# Altium schematic sheet ESP_Sheild.SchDoc
size A4; SheetNumber: 1; SheetTotal: 1
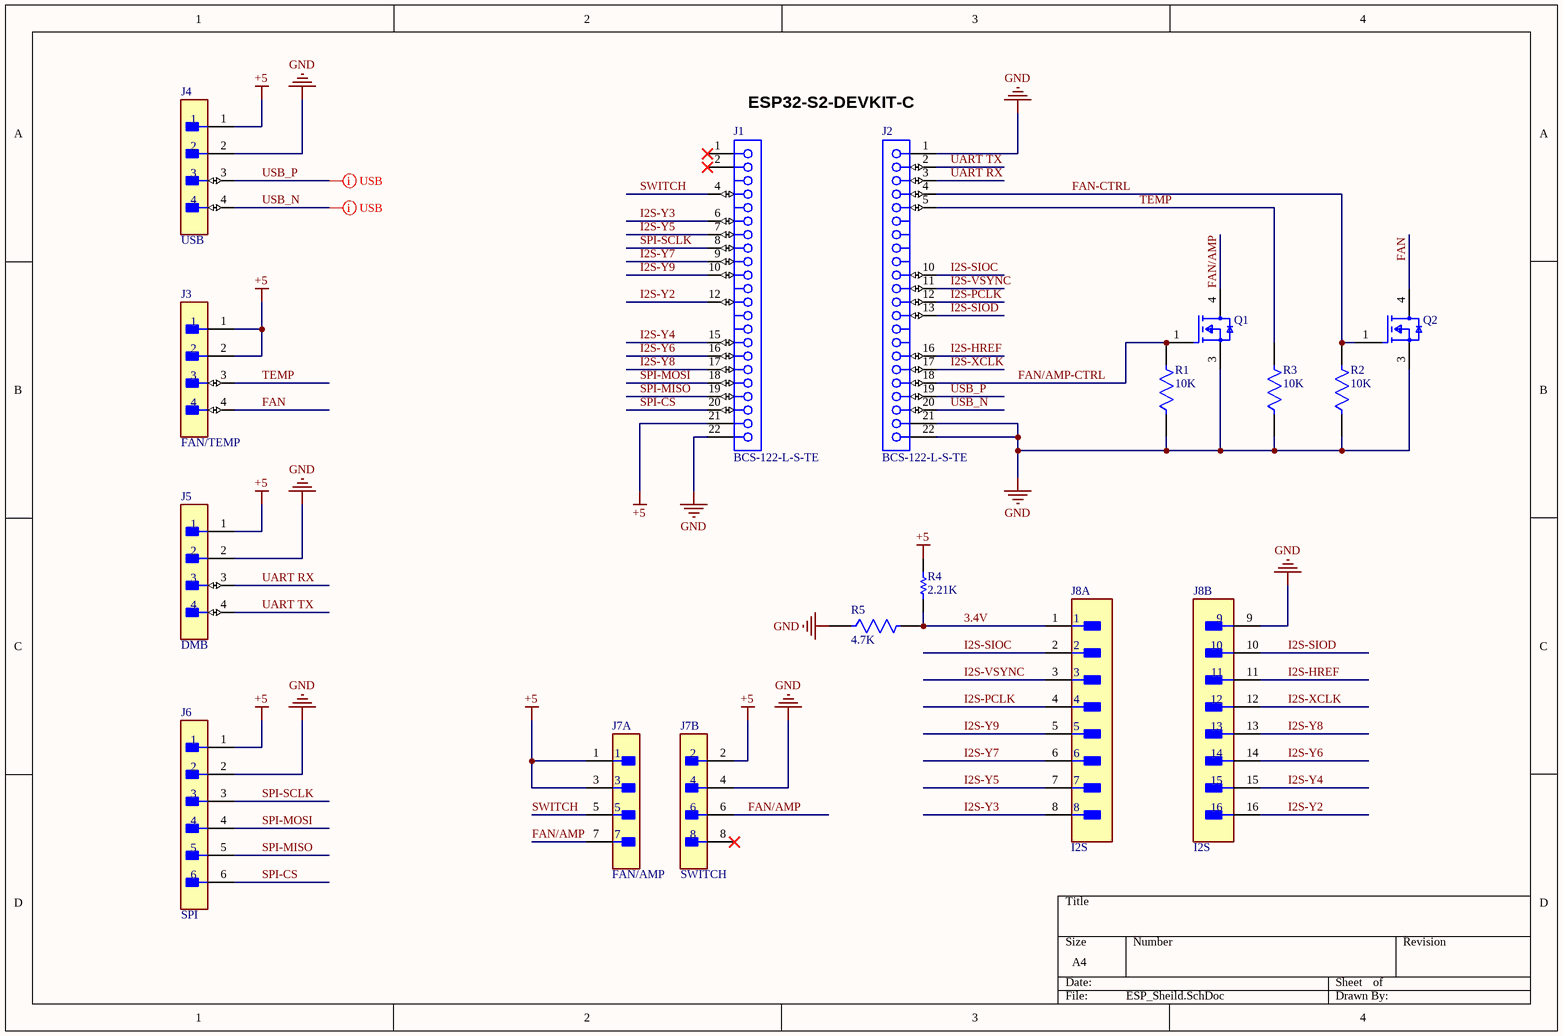
[diagram p0: ESP_Sheild.SchDoc]

## Parts
J1  BCS-122-L-S-TE  [SMTC-BCS-122-X-S-TE]
J2  BCS-122-L-S-TE  [SMTC-BCS-122-X-S-TE]
J3  FAN/TEMP  [FP-43045-0400-MFG]
J4  USB  [FP-43045-0400-MFG]
J5  DMB  [FP-43045-0400-MFG]
J6  SPI  [FP-43045-0612-MFG]
J7  FAN/AMP  [FP-43045-0827-0]  (parts A,B of 2)
J8  I2S  [FP-1723161216-MFG]  (parts A,B of 2)
Q1  DMN6068LK3-13  [FP-TO252_DPAK-MFG]  (value not drawn)
Q2  DMN6068LK3-13  [FP-TO252_DPAK-MFG]  (value not drawn)
R1  10K  [FP-ERJ3G-IPC_A]
R2  10K  [FP-ERJ3G-IPC_A]
R3  10K  [FP-ERJ3G-IPC_A]
R4  2.21K  [RESC1608X55X30LL15T15]
R5  4.7K  [FP-RMCF0603-MFG]

## Nets
+5: J1.21(5V) J3.1(5V) J3.2(5V) J4.1(5V) J5.1(5V) J6.1(5V) J7.1(5V) J7.2 J7.3(5V) R4.2
GND: J1.22(GND) J2.1(GND) J2.21(GND) J2.22(GND) J4.2(GND) J5.2(GND) J6.2(GND) J7.4 J8.9 Q1.3(S) Q2.3(S) R1.1 R2.1 R3.1 R5.1
3.4V: J8.1(3V3) R4.1 R5.2
FAN: J3.4(FAN) Q2.4(D)
FAN-CTRL: J2.4(GPIO1) Q2.1(G) R2.2
FAN/AMP: J7.6 J7.7(FAN/AMP) Q1.4(D)
FAN/AMP-CTRL: J2.18(GPIO21) Q1.1(G) R1.2
I2S-HREF: J2.16(GPIO34) J8.11
I2S-PCLK: J2.12(GPIO36) J8.4(VSYNC)
I2S-SIOC: J2.10(GPIO38) J8.2(PCLK)
I2S-SIOD: J2.13(GPIO35) J8.10
I2S-VSYNC: J2.11(GPIO37) J8.3(HREF)
I2S-XCLK: J2.17(GPIO33) J8.12
I2S-Y2: J1.12(GPIO8) J8.16
I2S-Y3: J1.6(GPIO6) J8.8(Y2)
I2S-Y4: J1.15(GPIO9) J8.15
I2S-Y5: J1.7(GPIO7) J8.7(XCLK)
I2S-Y6: J1.16(GPIO10) J8.14
I2S-Y7: J1.9(GPIO16) J8.6(SIOD)
I2S-Y8: J1.17(GPIO11) J8.13
I2S-Y9: J1.10(GPIO17) J8.5(SIOC)
SPI-CS: J1.20(GPIO14) J6.6(CS)
SPI-MISO: J1.19(GPIO13) J6.5(MISO)
SPI-MOSI: J1.18(GPIO12) J6.4(MOSI)
SPI-SCLK: J1.8(GPIO15) J6.3(SCLK)
SWITCH: J1.4(GPIO4) J7.5(FAN/AMP)
TEMP: J2.5(GPIO2) J3.3(TEMP) R3.2
UART RX: J2.3(GPIO44) J5.3(UART-TX)
UART TX: J2.2(GPIO43) J5.4(UART-RX)
USB_N: J2.20(GPIO19) J4.4
USB_P: J2.19(GPIO20) J4.3

Not connected (* = marked no-connect by the designer): J1 1(3V3)* 2(3V3)* 3(RST) 5(GPIO5) 11(GPIO18) 13(GPIO3) 14(GPIO46); J2 6(GPIO42) 7(GPIO41) 8(GPIO40) 9(GPIO39) 14(GPIO0) 15(GPIO45); J7 8*

## Layout directives
differential pair; net class USB; differential pair class USB_LINES; rule Differential Pairs Routing [Pref Gap = 0.254mm    Min Gap  = 0.254mm    Max Gap  = 0.254mmPref Width = 0.381mm    Min Width  = 0.381mm    Max Width  = 0.381mm]: USB_N, USB_P

## Notes on the sheet
- ESP32-S2-DEVKIT-C

## Library data of the parts
J1 J2 = CMP-00011-1: Conn Socket Strip SKT 22 POS 2.54mm Solder ST Thru-Hole Tube; Number of Positions: 22; Voltage Rating: 475V; Connector Type: Receptacle; Contact Resistance: 10mR; Max Current Rating: 5.9A; Lead Free: Lead Free; Max Operating Temperature: 125°C; Contact Plating: Gold; Color: Black; Min Operating Temperature: -55°C; RoHS Compliant: Yes; Housing Material: Polymer; Mount: Through Hole; Housing Color: Black; Number of Rows: 1; Contact Material: Bronze; Orientation: Vertical; Pitch: 2.54mm; Package Quantity: 1; Packaging: Bulk; REACH SVHC: No SVHC; Length: 55.88mm; Depth: 2.54mm; Radiation Hardening: No; Max Voltage Rating (AC): 475V; Gender: Receptacle; Termination: Solder; Number of Contacts: 22; Series: Tiger Claw™ BCS
J3 = CMP-04776-000002-1: CONN HEADER R/A 4POS 3MM / FAN/THERMISISTOR; Manufacturer Part Number: 43045-0400; Manufacturer: Molex; Conn Gender: Male; Conn Orientation: Right Angle; Voltage Rating: 600V; Number Of Contacts: 4; Is Female: yes; Current Rating: 8.5A; ComponentLink2URL: https://www.molex.com/webdocs/datasheets/pdf/en-us/0430450400_PCB_HEADERS.pdf; Digikey Description: CONN HEADER R/A 4POS 3MM; Category: Conn; Temperature Range High: +105°C; Lead Free: Yes; Device Class L1: Connectors; Automotive: No; Temperature: -40°C to +105°C; Footprint Url: https://www.molex.com/pdm_docs/sd/430450400_sd.pdf; Height: 9.27mm; Number Of Rows: 2; Device Class L3: unset; Pitch: 3mm; Temperature Range Low: -40°C; Contact Material: Tin,Nickel; Octopart: https://octopart.com/43045-0400-molex-287063; RoHS: TRUE; ComponentLink2Description: Datasheet; Package: 43045-0400; Device Class L2: Headers and Wire Housings
J4 = CMP-04776-000002-1: CONN HEADER R/A 4POS 3MM; Manufacturer Part Number: 43045-0400; Manufacturer: Molex; Conn Gender: Male; Conn Orientation: Right Angle; Voltage Rating: 600V; Number Of Contacts: 4; Is Female: yes; Current Rating: 8.5A; ComponentLink2URL: https://www.molex.com/webdocs/datasheets/pdf/en-us/0430450400_PCB_HEADERS.pdf; Digikey Description: CONN HEADER R/A 4POS 3MM; Category: Conn; Temperature Range High: +105°C; Lead Free: Yes; Device Class L1: Connectors; Automotive: No; Temperature: -40°C to +105°C; Footprint Url: https://www.molex.com/pdm_docs/sd/430450400_sd.pdf; Height: 9.27mm; Number Of Rows: 2; Device Class L3: unset; Pitch: 3mm; Temperature Range Low: -40°C; Contact Material: Tin,Nickel; Octopart: https://octopart.com/43045-0400-molex-287063; RoHS: TRUE; ComponentLink2Description: Datasheet; Package: 43045-0400; Device Class L2: Headers and Wire Housings
J5 = CMP-04776-000002-1: CONN HEADER R/A 4POS 3MM / DMB UART; Manufacturer Part Number: 43045-0400; Manufacturer: Molex; Conn Gender: Male; Conn Orientation: Right Angle; Voltage Rating: 600V; Number Of Contacts: 4; Is Female: yes; Current Rating: 8.5A; ComponentLink2URL: https://www.molex.com/webdocs/datasheets/pdf/en-us/0430450400_PCB_HEADERS.pdf; Digikey Description: CONN HEADER R/A 4POS 3MM; Category: Conn; Temperature Range High: +105°C; Lead Free: Yes; Device Class L1: Connectors; Automotive: No; Temperature: -40°C to +105°C; Footprint Url: https://www.molex.com/pdm_docs/sd/430450400_sd.pdf; Height: 9.27mm; Number Of Rows: 2; Device Class L3: unset; Pitch: 3mm; Temperature Range Low: -40°C; Contact Material: Tin,Nickel; Octopart: https://octopart.com/43045-0400-molex-287063; RoHS: TRUE; ComponentLink2Description: Datasheet; Package: 43045-0400; Device Class L2: Headers and Wire Housings
J6 = CMP-04776-000333-1: CONN HEADER VERT 6POS 3MM; Number of Ports: 1; Gender: Male; Approvals: UL; Max Current Rating: 5A; Glow Wire Compliant: Compliant; Number of Terminals/Pins: 6; Max Voltage Rating (DC): 250.25kV; Contact Resistance: 10mR; Voltage Rating: 250V; Orientation: Vertical; Height: 9.91mm; Housing Color: Black; Contact Material: Brass; RoHS Compliant: Yes; Housing Material: Polymer; Termination: Solder; Min Operating Temperature: -40°C; Material: Thermoplastic; Contact Plating: Tin; Diameter: 3mm; Radiation Hardening: No; Case/Package: 0612; Mount: Through Hole; Length: 13.15mm; Depth: 8.77mm; Max Operating Temperature: 105°C; Flammability Rating: UL94 V-0; Current Rating: 5A; Lead Free: Lead Free; Halogen Free: Low Halogen; Number of Rows: 2; Series: 43045; Pitch: 3mm; Package Quantity: 1728; Number of Circuits: 6; Number of Contacts: 6; Row Spacing: 3mm; Packaging: Tray; Color: Black; Number of Positions: 6
J7 = CMP-04776-000339-1: CONN HEADER VERT 8POS 3MM; Number of Positions: 8; Current Rating: 5A; Voltage Rating: 250V; Gender: Male; Glow Wire Compliant: Compliant; Housing Material: Thermoplastic; RoHS Compliant: Yes; Radiation Hardening: No; Row Spacing: 3mm; Halogen Free: Low Halogen; Number of Contacts: 8; Package Quantity: 1440; Contact Plating: Tin; Number of Circuits: 8; Series: 43045; Termination: Through Hole; Pitch: 3mm; Packaging: Tray; Number of Rows: 2; Orientation: Vertical; Contact Material: Brass
J8 = CMP-04776-000044-1: CONN HEADER R/A 16POS 3.5MM; Manufacturer Part Number: 1723161216; Manufacturer: Molex; Current Rating: 11A; Voltage Rating: 400V; Standoff Height: 0.05mm; Conn Gender: Male; Number Of Contacts: 16; Conn Orientation: Right Angle; Temperature: -40°C to +120°C; Pitch: 3.5mm; Height: 13.81mm; Temperature Range Low: -40°C; Automotive: No; Footprint Url: https://www.molex.com/pdm_docs/sd/1723161216_sd.pdf; Digikey Description: CONN HEADER R/A 16POS 3.5MM; Category: Conn; Package: 1723161216; ComponentLink2Description: Datasheet; ComponentLink2URL: https://www.molex.com/webdocs/datasheets/pdf/en-us/1723161216_PCB_HEADERS.pdf; Device Class L1: Connectors; RoHS: TRUE; Mouser Description: Ultra-Fit Right Angle Header, 3.50mm Pitch, Dual Row, 16 Circuits,; Temperature Range High: +120°C; Contact Material: Gold,Nickel; Device Class L3: unset; Number Of Rows: 2; Lead Free: Yes; Device Class L2: Headers and Wire Housings; Octopart: https://octopart.com/172316-1216-molex-60760060
Q1 Q2 = CMP-00012-1: VDS=60V VGS=±20V ID=8.5A P=2.12W; Drain to Source Voltage (Vdss): 60V; Polarity: N-CHANNEL; Continuous Drain Current (ID): 8.5A; Drain to Source Resistance: 68mR; Input Capacitance: 502pF; Number of Elements: 1; Gate to Source Voltage (Vgs): 20V; Fall Time: 8.7ns; Max Power Dissipation: 2.12W; Turn-Off Delay Time: 11.9ns; Element Configuration: Single; Turn-On Delay Time: 3.6ns; Rise Time: 10.8ns; Length: 6.73mm; Package Quantity: 2500; Number of Pins: 3; REACH SVHC: No SVHC; Series: -; Max Operating Temperature: 150°C; Number of Channels: 1; Weight: 0.139332oz; Drain to Source Breakdown Voltage: 60V; Width: 6.22mm; Min Operating Temperature: -55°C; Height: 2.39mm; Mount: Surface Mount; Lead Free: Lead Free; Case/Package: TO-252-3; Rds On Max: 68mR; Packaging: Tape and Reel
R1-R3 = CMP-00016-1: 贴片电阻 10KΩ ±5% 1/10W ±200ppm/℃ 0603; Resistance: 10kR; Voltage Rating (DC): 50V; Power Rating: 100mW; Temperature Coefficient: 200ppm/°C; Working Voltage: 75V; Number of Terminations: 2; Case Code (Metric): 1608; Tolerance: 5%; Package Quantity: 1; Length: 1.6mm; Lead Free: Lead Free; Height: 0.45mm; Depth: 0.8mm; Width: 0.8mm; Features: Automotive AEC-Q200; Case Code (Imperial): 0603; Contact Plating: Tin; Termination: SMD/SMT; RoHS Compliant: Yes; Max Power Dissipation: 100mW; Weight: 7.1E-05oz; Series: ERJ; Max Operating Temperature: 155°C; Resistor Type: Thick Film; Resistance Tolerance: 5%; Construction: Rectangular; REACH SVHC: No SVHC; Technology: THICK FILM; Voltage Rating: 75V; Mount: Surface Mount; Packaging: Tape and Reel; Military Standard: Not; Case/Package: 0603; Min Operating Temperature: -55°C
R4 = CMP-00021-1: Res Thick Film 0603 2.21K Ohm 1% 1/10W +/-100ppm/ßC Molded SMD Punched Carrier T/R; Voltage Rating (DC): 50V; Max Power Dissipation: 100mW; Temperature Coefficient: 100ppm/°C; Resistance: 2.21kR; Voltage Rating: 75V; RoHS Compliant: Yes; Case/Package: 0603; Tolerance: 1%; Length: 1.6mm; Series: ERJ; Packaging: Tape and Reel; Mount: Surface Mount; Width: 0.8mm; Contact Plating: Tin; Number of Terminations: 2; Case Code (Metric): 1608; Termination: SMD/SMT; Resistance Tolerance: 1%; Height: 0.45mm; Package Quantity: 1; Lead Free: Lead Free; Depth: 0.8mm; Min Operating Temperature: -55°C; REACH SVHC: No SVHC; Military Standard: Not; Resistor Type: Thick Film; Size Code: 0603; Case Code (Imperial): 0603; Radiation Hardening: No; Power Rating: 100mW; Construction: Rectangular; Technology: THICK FILM; Features: Automotive AEC-Q200; Max Operating Temperature: 155°C
R5 = CMP-00014-1: Resistor Thick Film 0603 4.7K Ohm 1% 1/10W ±100ppm/°C Molded SMD SMD Paper T/R; Max Power Dissipation: 100mW; Resistance: 4.7kR; Tolerance: 1%; Case/Package: 0603; Packaging: Tape and Reel; Military Standard: Not; Lead Free: Lead Free; Temperature Coefficient: 100ppm/°C; Series: RMCF; Radiation Hardening: No; Features: Automotive AEC-Q200; Min Operating Temperature: -55°C; Max Operating Temperature: 155°C; RoHS Compliant: Yes; Length: 0.061inch; Mount: Surface Mount; Number of Terminations: 2; Depth: 0.8mm; Width: 0.031inch; Construction: Rectangular; Contact Plating: Tin,Matte; Case Code (Imperial): 0603; Case Code (Metric): 1608; Height: 0.022inch; Resistor Type: Thick Film; Power Rating: 100mW